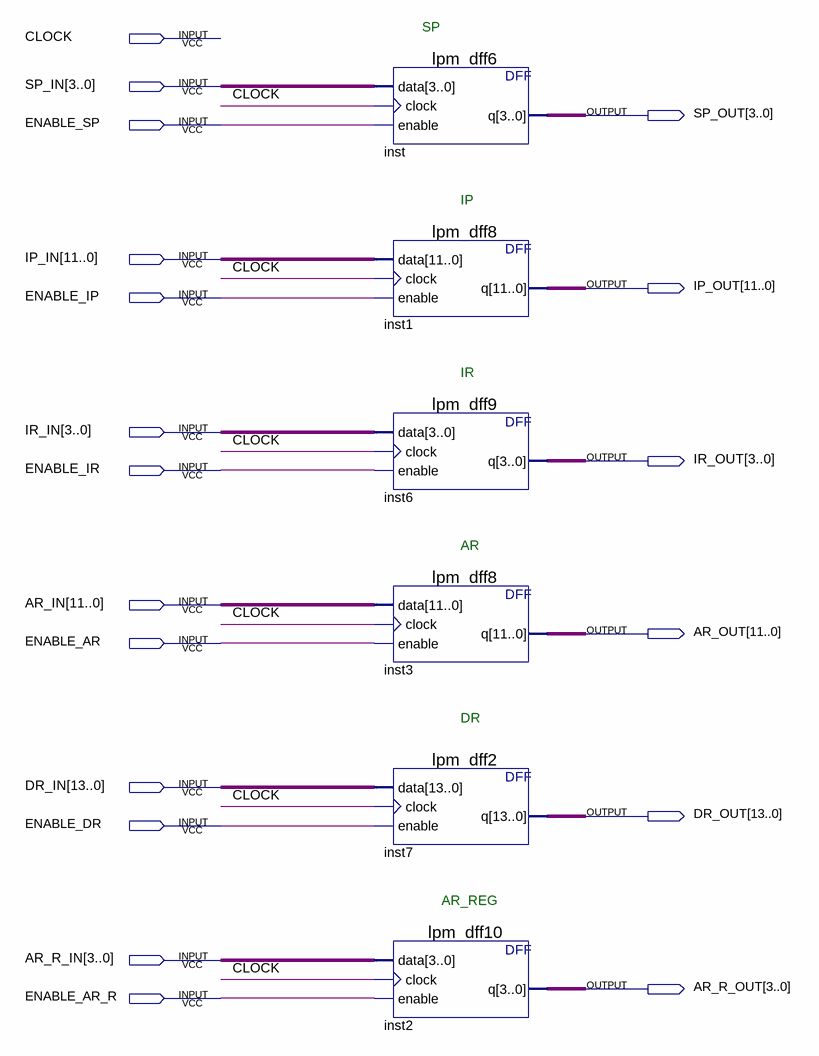
[diagram p0: schematic sheet]
// Quartus schematic REGISTERS.bdf as structural Verilog: 6 symbols, 19 pins
module REGISTERS (
  input  CLOCK,
  input  [3:0] SP_IN,
  input  ENABLE_SP,
  input  [11:0] IP_IN,
  input  ENABLE_IP,
  input  [3:0] IR_IN,
  input  ENABLE_IR,
  input  [11:0] AR_IN,
  input  ENABLE_AR,
  input  [13:0] DR_IN,
  input  ENABLE_DR,
  input  [3:0] AR_R_IN,
  input  ENABLE_AR_R,
  output [3:0] SP_OUT,
  output [11:0] IP_OUT,
  output [3:0] IR_OUT,
  output [11:0] AR_OUT,
  output [13:0] DR_OUT,
  output [3:0] AR_R_OUT
);

  lpm_dff6 inst (.data(SP_IN), .clock(CLOCK), .enable(ENABLE_SP), .q(SP_OUT));
  lpm_dff8 inst1 (.data(IP_IN), .clock(CLOCK), .enable(ENABLE_IP), .q(IP_OUT));
  lpm_dff9 inst6 (.data(IR_IN), .clock(CLOCK), .enable(ENABLE_IR), .q(IR_OUT));
  lpm_dff8 inst3 (.data(AR_IN), .clock(CLOCK), .enable(ENABLE_AR), .q(AR_OUT));
  lpm_dff2 inst7 (.data(DR_IN), .clock(CLOCK), .enable(ENABLE_DR), .q(DR_OUT));
  lpm_dff10 inst2 (.data(AR_R_IN), .clock(CLOCK), .enable(ENABLE_AR_R), .q(AR_R_OUT));

  // Notes on the sheet:
  //   SP
  //   IP
  //   IR
  //   AR
  //   DR
  //   AR_REG
endmodule
